# Altium project PCB_Project_Nuvoton.PrjPcb
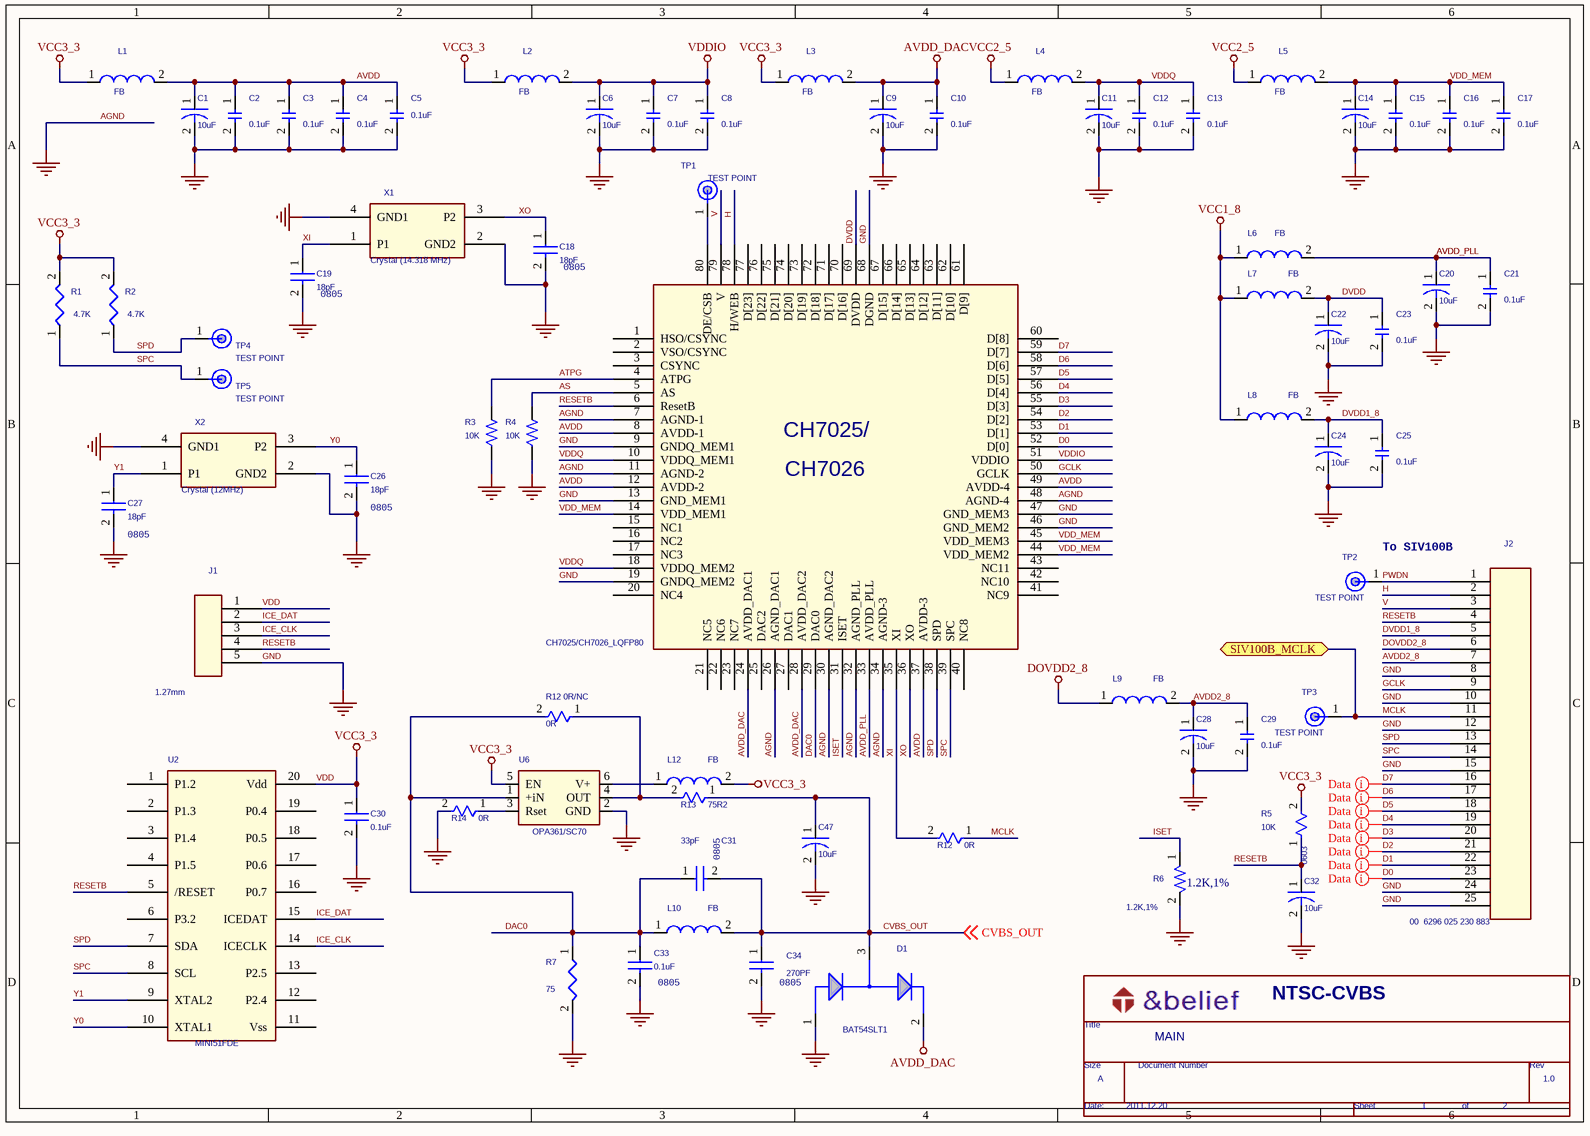
[diagram p0: MAIN.SchDoc]
2 sheets, 96 parts. Net scope: flat (ports and power ports of the same name join across sheets).
Board files: PCB.PcbDoc, PCB1.PcbDoc
Sheets:
  MAIN.SchDoc
  POWER.SchDoc

## Sheet MAIN.SchDoc
size 297 x 209 mm

### Parts
(Parts that share a designator on the sheet are numbered #1, #2 ... from top to bottom, then left to right.)
*#1  Page Modify Date: 2011.12.20  RevCode: 1.0  Title: MAIN  OrgName: NTSC-CVBS  Page Size: A  Page Number: 1  Page Count: 2  (hidden comment: TnBelief)  (graphical)
C1  10uF  [CAPC1608X90N]
C2  0.1uF  [CAPC1005X55N]
C3  0.1uF  [CAPC1005X55N]
C4  0.1uF  [CAPC1005X55N]
C5  0.1uF  [CAPC1005X55N]
C6  10uF  [CAPC1608X90N]
C7  0.1uF  [CAPC1005X55N]
C8  0.1uF  [CAPC1005X55N]
C9  10uF  [CAPC1608X90N]
C10  0.1uF  [CAPC1005X55N]
C11  10uF  [CAPC1608X90N]
C12  0.1uF  [CAPC1005X55N]
C13  0.1uF  [CAPC1005X55N]
C14  10uF  [CAPC1608X90N]
C15  0.1uF  [CAPC1005X55N]
C16  0.1uF  [CAPC1005X55N]
C17  0.1uF  [CAPC1005X55N]
C18  18pF  Part Shape: 0805  [CAPC1005X55N]
C19  18pF  Part Shape: 0805  [CAPC1005X55N]
C20  10uF  [CAPC1608X90N]
C21  0.1uF  [CAPC1005X55N]
C22  10uF  [CAPC1608X90N]
C23  0.1uF  [CAPC1005X55N]
C24  10uF  [CAPC1608X90N]
C25  0.1uF  [CAPC1005X55N]
C26  18pF  Part Shape: 0805  [CAPC1005X55N]
C27  18pF  Part Shape: 0805  [CAPC1005X55N]
C28  10uF  [CAPC1608X90N]
C29  0.1uF  [CAPC1005X55N]
C30  0.1uF  [CAPC1005X55N]
C31  33pF  Part Shape: 0805  [CAPC1005X55N]
C32  10uF  [CAPC1608X90N]
C33  0.1uF  Part Shape: 0805  [CAPC1005X55N]
C34  270PF  Part Shape: 0805  [CAPC1005X55N]
C47  10uF  [CAPC1608X90N]
D1  BAT54SLT1  [SOT23-3]
J1  1.27mm  [JP 1.27mm]
J2  00  6296 025 230 883  [FPC ASSY 0.3MM]
L1  FB  [INDC1005N]
L2  FB  [INDC1005N]
L3  FB  [INDC1005N]
L4  FB  [INDC1005N]
L5  FB  [INDC1005N]
L6  FB  [INDC1005N]
L7  FB  [INDC1005N]
L8  FB  [INDC1005N]
L9  FB  [INDC1005N]
L10  FB  [INDC1608N]
L12  FB  [INDC1005N]
R1  4.7K  [RESC1005X40N]
R2  4.7K  [RESC1005X40N]
R3  10K  [RESC1005X40N]
R4  10K  [RESC1005X40N]
R5  10K  Size: 0603  [RESC1005X40N]
R6  1.2K,1%  [RESC1005X40N]
R7  75  [RESC1005X40N]
R12  0R  [RESC1005X40N]
R12_0R/NC  0R  [RESC1005X40N]
R13  75R2  [RESC1005X40N]
R14  0R  [RESC1005X40N]
TP1  TEST POINT  [TP-R20]
TP2  TEST POINT  [TP-R20]
TP3  TEST POINT  [TP-R20]
TP4  TEST POINT  [TP-R20]
TP5  TEST POINT  [TP-R20]
U1  CH7025/CH7026_LQFP80  [TQFP80_N]
U2  MINI51FDE  [TSSOP65P640X120-20N]
U6  OPA361/SC70  [SC07]
X1  Crystal (14.318 MHz)  [XTAL-4pin-3225]
X2  Crystal (12MHz)  [XTAL-4pin-3225]

### Ports
SIV100B_MCLK

### Nets
AGND: C1.2 C2.2 C3.2 C4.2 C5.2 C6.2 C7.2 C8.2 C9.2 C10.2 C11.2 C12.2 C13.2 C14.2 C15.2 C16.2 C17.2 C18.2 C19.2 C20.2 C21.2 C22.2 C23.2 C24.2 C25.2 C26.2 C27.2 C28.2 C29.2 C30.2 C32.2 C33.2 C34.2 C47.2 D1.1(GND) J1.5 J2.8 J2.10 J2.12 J2.15 J2.24 J2.25 R3.1 R4.1 R6.2 R7.2 R14.2 U1.7(AGND-1) U1.9(GNDQ_MEM1) U1.11(AGND-2) U1.13(GND_MEM1) U1.19(GNDQ_MEM2) U1.26(AGND_DAC1) U1.30(AGND_DAC2) U1.32(AGND_PLL) U1.34(AGND-3) U1.46(GND_MEM2) U1.47(GND_MEM3) U1.48(AGND-4) U1.68(DGND) U6.2(GND) X1.2(GND2) X1.4(GND1) X2.2(GND2) X2.4(GND1)  [also labelled GND]
AVDD_DAC: C9.1 C10.1 D1.2(VDD) L3.2 U1.24(AVDD_DAC1) U1.28(AVDD_DAC2)
DOVDD2_8: J2.6 L9.1
VCC1_8: L6.1 L7.1 L8.1
VCC2_5: L4.1 L5.1
VDD: C30.1 J1.1 L1.1 L2.1 L3.1 L12.2 R1.2 R2.2 R5.2 U2.20(Vdd) U6.5(EN)  [also labelled VCC3_3]
VDDIO: C6.1 C7.1 C8.1 L2.2 U1.51(VDDIO)
AS: R4.2 U1.5(AS)
ATPG: R3.2 U1.4(ATPG)
AVDD: C1.1 C2.1 C3.1 C4.1 C5.1 L1.2 U1.8(AVDD-1) U1.12(AVDD-2) U1.37(AVDD-3) U1.49(AVDD-4)
AVDD2_8: C28.1 C29.1 J2.7 L9.2
AVDD_PLL: C20.1 C21.1 L6.2 U1.33(AVDD_PLL)
CVBS_OUT: C31.2 C34.1 C47.1 D1.3(SIGNAL) L10.2 R13.1 ; off-sheet CVBS_OUT
D0: J2.23 U1.52(D[0])
D1: J2.22 U1.53(D[1])
D2: J2.21 U1.54(D[2])
D3: J2.20 U1.55(D[3])
D4: J2.19 U1.56(D[4])
D5: J2.18 U1.57(D[5])
D6: J2.17 U1.58(D[6])
D7: J2.16 U1.59(D[7])
DAC0: C31.1 C33.1 L10.1 R7.1 R12_0R/NC.2 U1.29(DAC0) U6.1(+iN)
DVDD: C22.1 C23.1 L7.2 U1.69(DVDD)
DVDD1_8: C24.1 C25.1 J2.5 L8.2
GCLK: J2.9 U1.50(GCLK)
H: J2.2 U1.78(H/WEB)
ICE_CLK: J1.3 U2.14(ICECLK)
ICE_DAT: J1.2 U2.15(ICEDAT)
ISET: R6.1 U1.31(ISET)
MCLK: J2.11 R12.1 TP3.1 ; port SIV100B_MCLK
PWDN: J2.1 TP2.1
RESETB: C32.1 J1.4 J2.4 R5.1 U1.6(ResetB) U2.5(/RESET)
SPC: J2.14 R1.1 TP5.1 U1.39(SPC) U2.8(SCL)
SPD: J2.13 R2.1 TP4.1 U1.38(SPD) U2.7(SDA)
V: J2.3 U1.79(V)
VDD_MEM: C14.1 C15.1 C16.1 C17.1 L5.2 U1.14(VDD_MEM1) U1.44(VDD_MEM2) U1.45(VDD_MEM3)
VDDQ: C11.1 C12.1 C13.1 L4.2 U1.10(VDDQ_MEM1) U1.18(VDDQ_MEM2)
XI: C19.1 R12.2 U1.35(XI) X1.1(P1)
XO: C18.1 U1.36(XO) X1.3(P2)
Y0: C26.1 U2.10(XTAL1) X2.3(P2)
Y1: C27.1 U2.9(XTAL2) X2.1(P1)
NetL12_1: L12.1 U6.6(V+)
NetR12_0R/NC_1: R12_0R/NC.1 R13.2 U6.4(OUT)
NetR14_1: R14.1 U6.3(Rset)
NetTP1_1: TP1.1 U1.80(DE/CSB)

Not connected (* = marked no-connect by the designer): U1 1(HSO/CSYNC) 2(VSO/CSYNC) 3(CSYNC) 15(NC1) 16(NC2) 17(NC3) 20(NC4) 21(NC5) 22(NC6) 23(NC7) 25(DAC2) 27(DAC1) 40(NC8) 41(NC9) 42(NC10) 43(NC11) 60(D[8]) 61(D[9]) 62(D[10]) 63(D[11]) 64(D[12]) 65(D[13]) 66(D[14]) 67(D[15]) 70(D[16]) 71(D[17]) 72(D[18]) 73(D[19]) 74(D[20]) 75(D[21]) 76(D[22]) 77(D[23]); U2 1(P1.2) 2(P1.3) 3(P1.4) 4(P1.5) 6(P3.2) 11(Vss) 12(P2.4) 13(P2.5) 16(P0.7) 17(P0.6) 18(P0.5) 19(P0.4)

### Layout directives
net class Undefined: D0, D1, D2, D3, D4, D5, D6, D7

### Notes on the sheet
- (near TP2) To SIV100B
- (in symbol CH7025_LQFP80_0) CH7025/; CH7026
- (in symbol TnBelief) Title; Size; Document Number; Rev; Date:; Sheet; of

### Library data of the parts
*#1 = TnBelief: Doc: 2013. 05. 05 designed by ÀÌ  °­; Page Create Date: March  8, 1995
C1 C6 C9 C11 C14 C20 C24 = PCAP_0: CAP - 10uF 16V TE Tant; Mfr Code: KME; Manufacturer Part Num: T491B106M016AS; Manufacturer: Kemet; Part Class: CAPACITORS; Num Pins: 2; Item Num: P03-10463; Altera Prt #: P03-10463-00; Price: 0.1; Supplier Part Num: 399-1594-2-ND; # Pins: 2; Part Type: CAP; Manufaturer: Kemet; Manufaturer Part Number: T491B106M016AS; Supplier: Digikey; Supplier Prt #: 399-1594-2-ND
C2-C5 C7 C8 C10 C12 C13 C15-C17 C21 C23 C25 C29 = C_0: DIST: FLAT; PSpiceTemplate: C^@REFDES %1 %2 ?TOLERANCE|C^@REFDES| @VALUE ?IC/IC=@IC/ ?TOLERANCE|\n.model C^@REFDES CAP C=1 DEV=@TOLERANCE%|; VOLTAGE: CMAX; CURRENT: CIMAX; KNEE: CBMAX; SLOPE: CSMAX; MAX_TEMP: CTMAX; Value: 0.1uF
C18 C19 C26 C27 C31 C33 C34 = CAP
C22 C28 C32 C47 = PCAP_0: CAP - 10uF 16V TE Tant; Manufaturer Part Number: T491B106M016AS; Manufaturer: Kemet; Part Class: CAPACITORS; Mfr Code: KME; # Pins: 2; Altera Prt #: P03-10463-00; Item Num: P03-10463; Supplier Prt #: 399-1594-2-ND; Supplier: Digikey; Part Type: CAP; Num Pins: 2; Manufacturer: Kemet; Manufacturer Part Num: T491B106M016AS; Supplier Part Num: 399-1594-2-ND; Price: 0.1
C30 = CAP NP_3
D1 = DIODE DUAL SERIES SOT23: Seperator: /; Instance: 091-00
J1 = CON5_Dup1
J2 = CON25
L1-L10 L12 = INDUCTOR
R1 R2 R7 = RESISTOR
R3 R4 = R: POWER: RMAX; MAX_TEMP: RTMAX; SLOPE: RSMAX; VOLTAGE: RVMAX; PSpiceTemplate: R^@REFDES %1 %2 ?TOLERANCE|R^@REFDES| @VALUE  ?TOLERANCE|\n.model R^@REFDES RES R=1 DEV=@TOLERANCE%|; DIST: FLAT; Value: 10K
R5 = 0R,1/10W,5%,0603_9: 0R,1/10W,5%,0603; Part Decal: R0603; Tolerance: ¡Ó5%; COMP_TYPE: SMD; Category: RES; Property A: 1/10W; Property B: 5%; Property C: 0603; Thickness: 0.55mm
R6 = R_4: POWER: RMAX; MAX_TEMP: RTMAX; SLOPE: RSMAX; VOLTAGE: RVMAX; PSpiceTemplate: R^@REFDES %1 %2 ?TOLERANCE|R^@REFDES| @VALUE  ?TOLERANCE|\n.model R^@REFDES RES R=1 DEV=@TOLERANCE%|; DIST: FLAT; Value: 1.2K,1%
R12 R12_0R/NC R13 R14 = 0R,1/10W,5%,0603_9: 0R,1/10W,5%,0603; Part Decal: R0603; Property C: 0603; Tolerance: ¡Ó5%; COMP_TYPE: SMD; Category: RES; Property A: 1/10W; Property B: 5%; Thickness: 0.55mm
TP1 TP4 TP5 = Test Point_0
TP2 = Test Point_1
TP3 = Test Point_2
U1 = CH7025_LQFP80_0
U2 = IC TvDecoder TI TVP5150 QFP32_2
U6 = IC DC/DC RT8258 SOT26_0
X1 = 535-9118-1-ND_0
X2 = 535-9118-1-ND_1

## Sheet POWER.SchDoc
size 297 x 209 mm
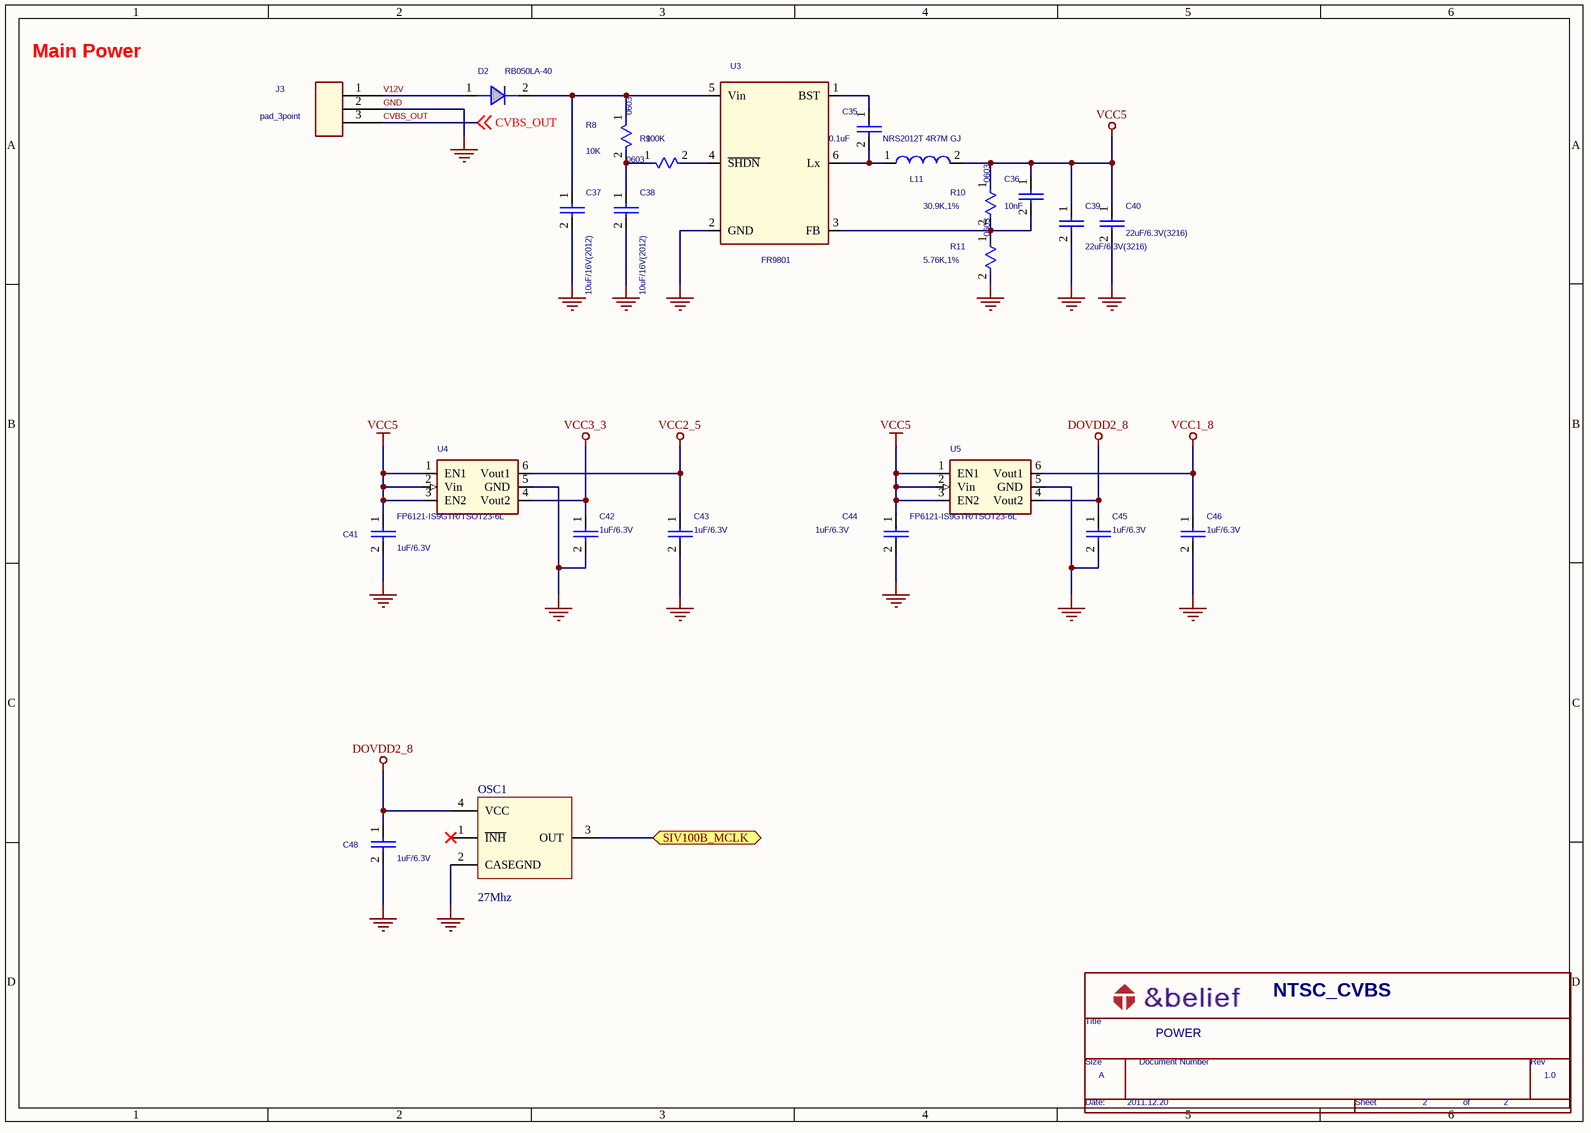
[diagram p1: POWER.SchDoc]

### Parts
(Parts that share a designator on the sheet are numbered #1, #2 ... from top to bottom, then left to right.)
*#2  Page Modify Date: 2011.12.20  RevCode: 1.0  Title: POWER  OrgName: NTSC_CVBS  Page Size: A  Page Number: 2  (hidden comment: TnBelief)  (graphical)
C35  0.1uF  [CAPC1005X55N]
C36  10nF  [CAPC1005X55N]
C37  10uF/16V(2012)  [CAPC2012X135N]
C38  10uF/16V(2012)  [CAPC2012X135N]
C39  22uF/6.3V(3216)  [CAPC3216X100N]
C40  22uF/6.3V(3216)  [CAPC3216X100N]
C41  1uF/6.3V  [CAPC1608X90N]
C42  1uF/6.3V  [CAPC1608X90N]
C43  1uF/6.3V  [CAPC1608X90N]
C44  1uF/6.3V  [CAPC1608X90N]
C45  1uF/6.3V  [CAPC1608X90N]
C46  1uF/6.3V  [CAPC1608X90N]
C48  1uF/6.3V  [CAPC1608X90N]
D2  RB050LA-40  [RB50LA-40]
J3  pad_3point  [Jump_3Way_Text1]
L11  NRS2012T 4R7M GJ  [INDC2016X180N]
OSC1  27Mhz  [XTAL-4pin-3225]
R8  10K  Size: 0603  [RESC1005X40N]
R9  100K  Size: 0603  [RESC1005X40N]
R10  30.9K,1%  Size: 0603  [RESC1005X40N]
R11  5.76K,1%  Size: 0603  [RESC1005X40N]
U3  FR9801  [SOT23-6]
U4  FP6121-IS9GTR/TSOT23-6L  [SOT23-6]
U5  FP6121-IS9GTR/TSOT23-6L  [SOT23-6]

### Ports
SIV100B_MCLK

### Nets
DOVDD2_8: C45.1 C48.1 OSC1.4(VCC) U5.4(Vout2)
GND: C37.2 C38.2 C39.2 C40.2 C41.2 C42.2 C43.2 C44.2 C45.2 C46.2 C48.2 J3.2 OSC1.2(CASEGND) R11.2 U3.2(GND) U4.5(GND) U5.5(GND)  [project net AGND]
VCC1_8: C46.1 U5.6(Vout1)
VCC2_5: C43.1 U4.6(Vout1)
VCC3_3: C42.1 U4.4(Vout2)  [project net VDD]
VCC5: C36.1 C39.1 C40.1 C41.1 C44.1 L11.2 R10.1 U4.1(EN1) U4.2(Vin) U4.3(EN2) U5.1(EN1) U5.2(Vin) U5.3(EN2)
CVBS_OUT: J3.3 ; off-sheet CVBS_OUT
MCLK: OSC1.3(OUT) ; port SIV100B_MCLK
V12V: D2.1 J3.1
NetC35_1: C35.1 U3.1(BST)
NetC35_2: C35.2 L11.1 U3.6(Lx)
NetC36_2: C36.2 R10.2 R11.1 U3.3(FB)
NetC37_1: C37.1 D2.2 R8.1 U3.5(Vin)
NetC38_1: C38.1 R8.2 R9.1
NetR9_2: R9.2 U3.4(~{SHDN})

Not connected (* = marked no-connect by the designer): OSC1 1(~{INH})*

### Notes on the sheet
- Main Power
- (in symbol TnBelief) Title; Size; Document Number; Rev; Date:; Sheet; of

### Library data of the parts
*#2 = TnBelief: Doc: 2013. 05. 05 designed by ÀÌ  °­; Page Create Date: March  8, 1995; Page Count: 2
C35 = CAP NP_16
C36 = CAP NP_13
C37 = CAP NP_17
C38 = CAP NP_18
C39 = CAP NP_15
C40 = CAP NP_14
C41 C44 C48 = CAP NP_0
C42 C43 C45 C46 = CAP NP_1
D2 = DIODE PIN_1
J3 = CON3
L11 = INDUCTOR_0
OSC1 = XO_50Mhz_3V3_50ppm_SMD: OSC XO 50.000MHZ CMOS SMD
R8 R9 = 0R,1/10W,5%,0603_0: 0R,1/10W,5%,0603; Part Decal: R0603; Tolerance: ¡Ó5%; COMP_TYPE: SMD; Category: RES; Property A: 1/10W; Property B: 5%; Property C: 0603; Thickness: 0.55mm
R10 = 0R,1/10W,5%,0603_10: 0R,1/10W,5%,0603; Part Decal: R0603; Tolerance: ¡Ó5%; COMP_TYPE: SMD; Category: RES; Property A: 1/10W; Property B: 5%; Property C: 0603; Thickness: 0.55mm
R11 = 0R,1/10W,5%,0603_11: 0R,1/10W,5%,0603; Part Decal: R0603; Tolerance: ¡Ó5%; COMP_TYPE: SMD; Category: RES; Property A: 1/10W; Property B: 5%; Property C: 0603; Thickness: 0.55mm
U3 = R1244N001B_1
U4 U5 = IC DC/DC RT8258 SOT26_0

## Nets that join several sheets
AGND: MAIN (65 pins), POWER (17 pins)
DOVDD2_8: MAIN (J2.6 L9.1), POWER (C45.1 C48.1 OSC1.4 U5.4)
VCC1_8: MAIN (L6.1 L7.1 L8.1), POWER (C46.1 U5.6)
VCC2_5: MAIN (L4.1 L5.1), POWER (C43.1 U4.6)
VDD: MAIN (11 pins), POWER (C42.1 U4.4)
CVBS_OUT: MAIN (6 pins), POWER (J3.3)
MCLK: MAIN (J2.11 R12.1 TP3.1), POWER (OSC1.3)